# Altium schematic sheet Block_Diagram.schdoc
size A3; SheetNumber: 2; SheetTotal: 4
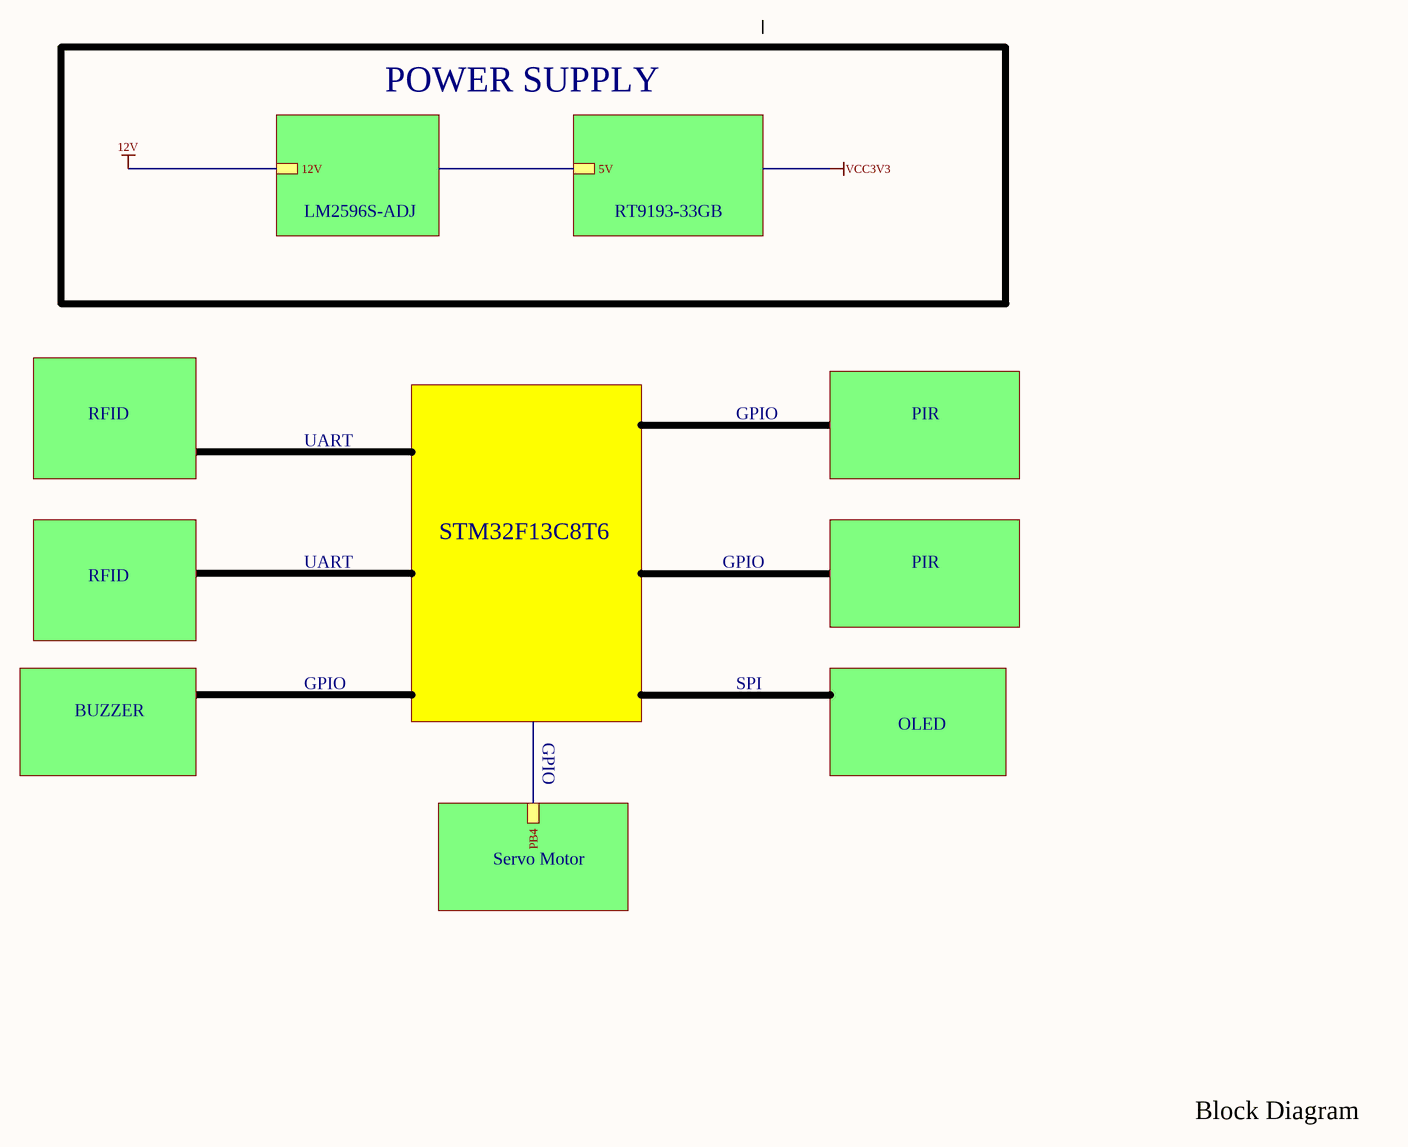
[diagram p0: Block_Diagram.schdoc]

## Sub-sheets
BUZZER = ?: no entries
LM2596S-ADJ = ?: 12V
OLED = ?: no entries
PIR = ?: no entries
PIR = ?: no entries
RFID = ?: no entries
RFID = ?: no entries
RT9193-33GB = ?: 5V
Servo Motor = ?: PB4
? = STM32F13C8T6: no entries

## Nets
12V: sheet LM2596S-ADJ/12V

## Notes on the sheet
- POWER SUPPLY
- UART
- GPIO
- SPI
- Block Diagram